# Altium schematic sheet DSP_Power.SchDoc
size Letter
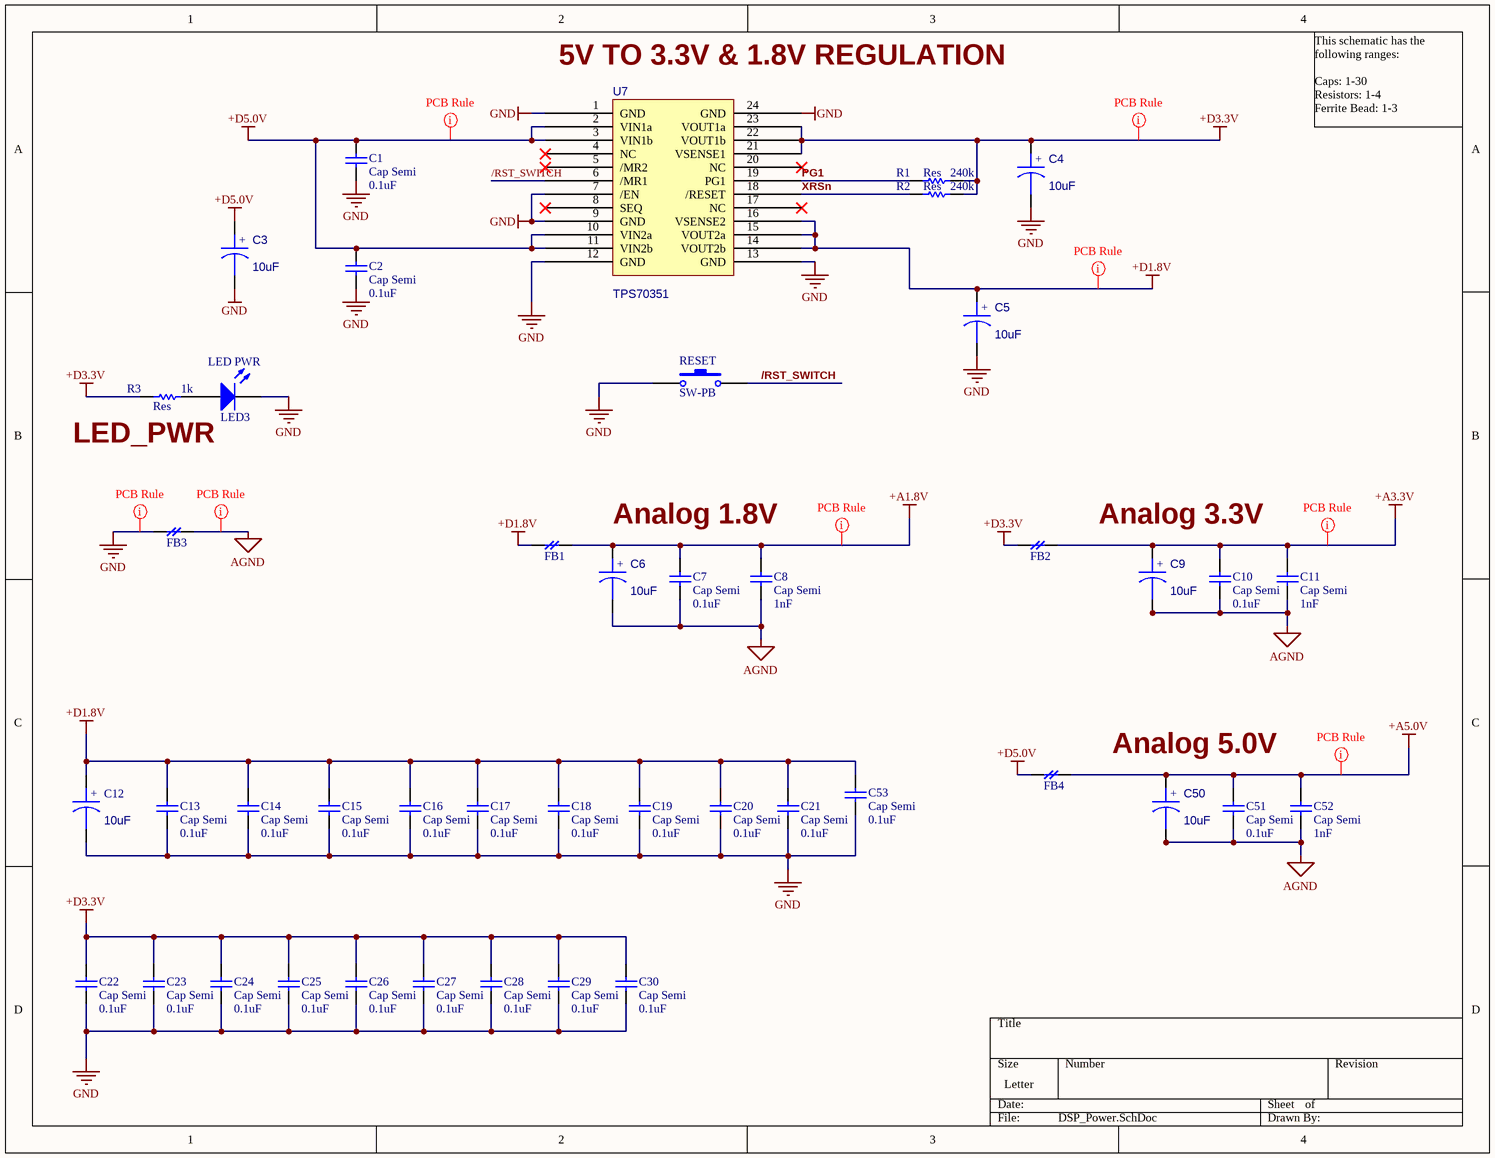
[diagram p0: DSP_Power.SchDoc]

## Parts
C1  Cap Semi  value 0.1uF  [0805]
C2  Cap Semi  value 0.1uF  [0805]
C3  10uF  [3528]
C4  10uF  [3528]
C5  10uF  [3528]
C6  10uF  [3528]
C7  Cap Semi  value 0.1uF  [0805]
C8  Cap Semi  value 1nF  [0805]
C9  10uF  [3528]
C10  Cap Semi  value 0.1uF  [0805]
C11  Cap Semi  value 1nF  [0805]
C12  10uF  [3528]
C13  Cap Semi  value 0.1uF  [0805]
C14  Cap Semi  value 0.1uF  [0805]
C15  Cap Semi  value 0.1uF  [0805]
C16  Cap Semi  value 0.1uF  [0805]
C17  Cap Semi  value 0.1uF  [0805]
C18  Cap Semi  value 0.1uF  [0805]
C19  Cap Semi  value 0.1uF  [0805]
C20  Cap Semi  value 0.1uF  [0805]
C21  Cap Semi  value 0.1uF  [0805]
C22  Cap Semi  value 0.1uF  [0805]
C23  Cap Semi  value 0.1uF  [0805]
C24  Cap Semi  value 0.1uF  [0805]
C25  Cap Semi  value 0.1uF  [0805]
C26  Cap Semi  value 0.1uF  [0805]
C27  Cap Semi  value 0.1uF  [0805]
C28  Cap Semi  value 0.1uF  [0805]
C29  Cap Semi  value 0.1uF  [0805]
C30  Cap Semi  value 0.1uF  [0805]
C50  10uF  [3528]
C51  Cap Semi  value 0.1uF  [0805]
C52  Cap Semi  value 1nF  [0805]
C53  Cap Semi  value 0.1uF  [0805]
FB1  Ferrite_Bead  [CR2012-0805]  (value not drawn)
FB2  Ferrite_Bead  [CR2012-0805]  (value not drawn)
FB3  Ferrite_Bead  [CR2012-0805]  (value not drawn)
FB4  Ferrite_Bead  [CR2012-0805]  (value not drawn)
LED_PWR  LED3  [0805]
R1  Res  value 240k  [0805]
R2  Res  value 240k  [0805]
R3  Res  value 1k  [0805]
RESET  SW-PB  [SWITCH_2PAD_SMD]
U7  TPS70351  [PWP24]

## Nets
+A1.8V: C6.1 C7.2 C8.2 FB1.2
+A3.3V: C9.1 C10.2 C11.2 FB2.2
+A5.0V: C50.1 C51.2 C52.2 FB4.2
+D1.8V: C5.1 C12.1 C13.2 C14.2 C15.2 C16.2 C17.2 C18.2 C19.2 C20.2 C21.2 C53.2 FB1.1 U7.14(VOUT2b) U7.15(VOUT2a) U7.16(VSENSE2)
+D3.3V: C4.1 C22.2 C23.2 C24.2 C25.2 C26.2 C27.2 C28.2 C29.2 C30.2 FB2.1 R1.2 R2.2 R3.1 U7.21(VSENSE1) U7.22(VOUT1b) U7.23(VOUT1a)
+D5.0V: C1.2 C2.2 C3.1 FB4.1 U7.2(VIN1a) U7.3(VIN1b) U7.10(VIN2a) U7.11(VIN2b)
AGND: C6.2 C7.1 C8.1 C9.2 C10.1 C11.1 C50.2 C51.1 C52.1 FB3.2
GND: C1.1 C2.1 C3.2 C4.2 C5.2 C12.2 C13.1 C14.1 C15.1 C16.1 C17.1 C18.1 C19.1 C20.1 C21.1 C22.1 C23.1 C24.1 C25.1 C26.1 C27.1 C28.1 C29.1 C30.1 C53.1 FB3.1 LED_PWR.2(K) RESET.1 U7.1(GND) U7.7(/EN) U7.9(GND) U7.12(GND) U7.13(GND) U7.24(GND)
/RST_SWITCH: RESET.2 U7.6(/MR1)
PG1: R1.1 U7.19(PG1)
XRSn: R2.1 U7.18(/RESET)
NetLED_PWR_1: LED_PWR.1(A) R3.2

Not connected (* = marked no-connect by the designer): U7 4(NC)* 5(/MR2)* 8(SEQ)* 17(NC)* 20(NC)*

## Layout directives
rule Width Constraint [Pref Width = 15mil    Min Width = 10mil    Max Width = 15mil]: +A1.8V, +A3.3V, +A5.0V, +D1.8V, +D3.3V, +D5.0V, AGND, GND

## Notes on the sheet
- (near U7) 5V TO 3.3V & 1.8V REGULATION
- This schematic has the following ranges:
  Caps: 1-30
  Resistors: 1-4
  Ferrite Bead: 1-3
- (near R3) LED_PWR
- Analog 1.8V
- Analog 3.3V
- Analog 5.0V
- (in symbol CAPACITOR POL) +

## Library data of the parts
C1 C2 C7 C8 C10 C11 C13-C30 C51-C53 = Cap Semi: Capacitor (Semiconductor SIM Model); Published: 8-Jun-2000; LatestRevisionDate: 17-Jul-2002; LatestRevisionNote: Re-released for DXP Platform.; PackageReference: C1206; Publisher: Altium Limited
C3 = CAPACITOR POL: digi-399-1563-1-ND
C4 C6 C9 C50 = CAPACITOR POL: digi-399-3096-1-ND
C5 C12 = CAPACITOR POL: digi-399-1576-1-ND
FB1-FB4 = Ferrite_Bead: Ferrite Bead; Digikey #: 445-1554-1-ND
LED_PWR = LED3: Typical BLUE SiC LED; Published: 8-Jun-2000; LatestRevisionDate: 17-Dec-2003; LatestRevisionNote: PCB Footprint replaced.; DatasheetDocument: 16-Apr-2002; PackageDocument: 16-Apr-2002; PackageReference: 3.5X2.8X1.9; Publisher: Altium Limited
R1-R3 = Res Semi: Semiconductor Resistor; Published: 8-Jun-2000; LatestRevisionDate: 17-Jul-2002; LatestRevisionNote: Re-released for DXP Platform.; PackageReference: AXIAL-0.5; Publisher: Altium Limited
RESET = SW-PB: Switch; Published: 24-Mar-1999; LatestRevisionDate: 17-Jul-2002; LatestRevisionNote: Re-released for DXP Platform.; PackageReference: SPST-2; Publisher: Altium Limited; Digikey #: CKN9119CT-ND
U7 = TPS70351: IC 3.3V/1.8V LDO REG 24-HTSSOP; Digikey #: 296-8024-5-ND